# Altium project Soldeerstation.PrjPcb
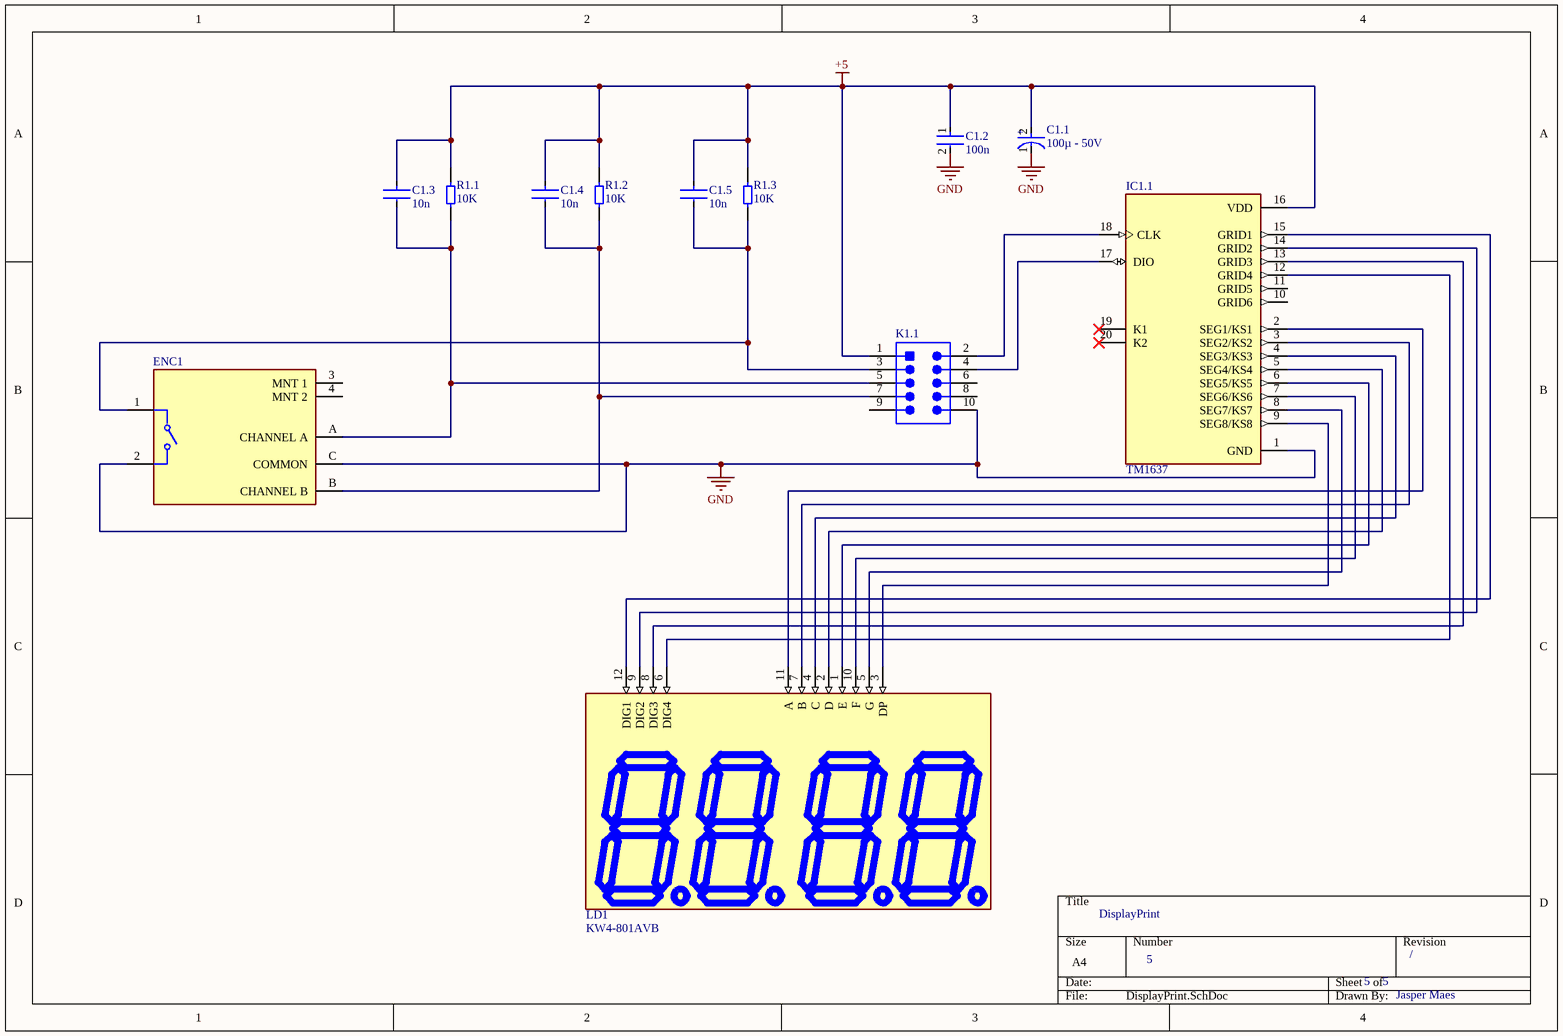
[diagram p0: DisplayPrint.SchDoc]
5 sheets, 76 parts. Net scope: flat (ports and power ports of the same name join across sheets).
Board file: PCB3.PcbDoc
Sheets:
  DisplayPrint.SchDoc
  Sturing_Bout.SchDoc
  Voeding.SchDoc
  Main_IC_Sheet.SchDoc
  temperatuursmeting.SchDoc

## Sheet DisplayPrint.SchDoc: DisplayPrint
size A4; Author: Jasper; DrawnBy: Jasper Maes; DocumentNumber: 5; Revision: /; SheetNumber: 5; SheetTotal: 5

### Parts
C1.1  100µ - 50V  [FP-RAD-TH-D_6_3_0_5-L_11-MFG]
C1.2  100n  [FP-C0805C-DN-IPC_A]
C1.3  10n  [FP-C0805C-DN-IPC_A]
C1.4  10n  [FP-C0805C-DN-IPC_A]
C1.5  10n  [FP-C0805C-DN-IPC_A]
ENC1  PEC11R-4215F-S0024  [FP-PEC11R-4215F-S0024-MFG]  (value not drawn)
IC1.1  TM1637  [N14A]
K1.1  1-1634688-0  [TECO-1-1634688-0-10_V]  (value not drawn)
LD1  KW4-801AVB  [LEDDIG_KW4-801AVB/KW4-801CVB_LUK]
R1.1  10K  [RESC2013X60X40ML20T25]
R1.2  10K  [RESC2013X60X40ML20T25]
R1.3  10K  [RESC2013X60X40ML20T25]

### Nets
+5: C1.1.2(A) C1.2.1 C1.3.1 C1.4.1 C1.5.1 IC1.1.16(VDD) K1.1.1 R1.1.1 R1.2.1 R1.3.1
GND: C1.1.1(C) C1.2.2 ENC1.2 ENC1.C(COMMON) IC1.1.1(GND) K1.1.10
NetC1.3_2: C1.3.2 ENC1.A(CHANNEL_A) K1.1.5 R1.1.2
NetC1.4_2: C1.4.2 ENC1.B(CHANNEL_B) K1.1.7 R1.2.2
NetC1.5_2: C1.5.2 ENC1.1 K1.1.3 R1.3.2
NetIC1.1_2: IC1.1.2(SEG1/KS1) LD1.11(A)
NetIC1.1_3: IC1.1.3(SEG2/KS2) LD1.7(B)
NetIC1.1_4: IC1.1.4(SEG3/KS3) LD1.4(C)
NetIC1.1_5: IC1.1.5(SEG4/KS4) LD1.2(D)
NetIC1.1_6: IC1.1.6(SEG5/KS5) LD1.1(E)
NetIC1.1_7: IC1.1.7(SEG6/KS6) LD1.10(F)
NetIC1.1_8: IC1.1.8(SEG7/KS7) LD1.5(G)
NetIC1.1_9: IC1.1.9(SEG8/KS8) LD1.3(DP)
NetIC1.1_12: IC1.1.12(GRID4) LD1.6(DIG4)
NetIC1.1_13: IC1.1.13(GRID3) LD1.8(DIG3)
NetIC1.1_14: IC1.1.14(GRID2) LD1.9(DIG2)
NetIC1.1_15: IC1.1.15(GRID1) LD1.12(DIG1)
NetIC1.1_17: IC1.1.17(DIO) K1.1.4
NetIC1.1_18: IC1.1.18(CLK) K1.1.2

Not connected (* = marked no-connect by the designer): ENC1 3(MNT_1) 4(MNT_2); IC1.1 10(GRID6) 11(GRID5) 19(K1)* 20(K2)*; K1.1 6 8 9

### Notes on the sheet
- (in symbol CMP-05427-000897-1) +

### Library data of the parts
C1.1 = CMP-05427-000897-1: Aluminum Electrolytic Capacitors (Radial Lead Type) 100uF ±20% 25V; ESR (Equivalent Series Resistance): 130mR; Ripple Current: 455mA; Polarity: Polar; Life (Hours): 2000Hour; Lead Diameter: 0.5mm; Tolerance: 20%; Radiation Hardening: No; Min Operating Temperature: -40°C; Series: FR; Max Operating Temperature: 105°C; Lead Free: Lead Free; Package Quantity: 2000; Capacitance: 100uF; Lead Pitch: 5mm; Voltage Rating (DC): 25V; Length: 11.2mm; Features: General Purpose; Mount: Through Hole; Voltage Rating: 25V; Case/Package: Radial; Impedance: 130mR; RoHS Compliant: Yes; Packaging: Tape and Reel; Height - Seated (Max): 0.441inch; Height: 11.2mm; Diameter: 6.3mm; Termination: Radial
C1.2-C1.5 = CMP-2007-00279-2: CAP CER 0.1UF 50V X7R 0805; Manufacturer Part Number: C0805C104K5RACTU; Manufacturer: KEMET; Value: 0.10 μF; Tolerance: 0.1; Temperature Coefficient: 30ppm/°C; Material: Ceramic; Device Class L2: Capacitors; Temperature Range Low: -55°C; Voltage Rating: 50 V; Digikey Description: CAP CER 0.1UF 50V X7R 0805; Category: Cap; ComponentLink2Description: Datasheet; Octopart: https://octopart.com/c0805c104k5ractu-kemet-143926; RoHS: TRUE; ComponentLink2URL: https://content.kemet.com/datasheets/KEM_C1003_C0G_SMD.pdf; Temperature Characteristic: X7R; Temperature: -55°C to +125°C; Height: 0.88mm; Temperature Range High: +125°C; Device Class L1: Passive Components; Automotive: No; Lead Free: Yes; Ipc Land Pattern Name: CAPC200125X78; Device Class L3: Ceramic Capacitors; Mouser Description: Cap Ceramic 0.1uF 50V X7R 10% SMD 2.0 x 1.2 mm 125 C Paper T/R; Capacitance: 0.10 μF; Package: C0805C-DN
ENC1 = CMP-1747-00012-2: ROTARY ENCODER MECHANICAL 24PPR; Hole Diameter: 1.8mm; Output Type: Quadrature; Pulses per Revolution: 24; Number of Channels: 2; Built in Switch: Yes; Min Operating Temperature: -30°C; Series: PEC11R; Type: Mechanical; Package Quantity: 150; Length: 21.5mm; Max Operating Temperature: 70°C; Encoder Type: Mechanical; Height: 13.4mm; Detent: Yes; Packaging: Bulk; Orientation: Vertical; Width: 12.5mm; Termination: PC Pins; Mount: Through Hole; REACH SVHC: No SVHC; Radiation Hardening: No; RoHS Compliant: Yes
IC1.1 = TM1637: LED Drive Control Special Circuit; MF: Titan Micro Electronics; Package: Package; Availability: Not in stock; SnapEDA_Link: https://www.snapeda.com/parts/TM1637/Titan+Micro+Electronics/view-part/?ref=snap; MP: TM1637; Check_prices: https://www.snapeda.com/parts/TM1637/Titan+Micro+Electronics/view-part/?ref=eda; Value: *; Price: None
K1.1 = CMP-2000-05854-1: Male Header, Pitch 2.54 mm, 2 x 5 Postion, Height 9.15 mm, Tail Length 3.2 mm, -40 to 105 degC, RoHS, Bulk; Manufacturer: TE Connectivity; No. of Rows: 2; SVHC: ToBeAdvised; Package Version: Rev. C2, 02/2011; No. of Contacts: 10Contacts; Pitch: 2.54mm; No. of Positions: 10; Contact Termination Type: ThroughHole; Package Description: 10-Pin Connector, Body 20.35 x 8.7 mm, Pitch 2.54 mm; Orientation: Straight; Gender: Header; Mounting Technology: ThroughHole; Product Range: -; PartNumber: 1-1634688-0; Datasheet Version: Rev. C2, 02/2011; Contact Material: Brass; Package URL: https://datasheet.ciiva.com/6831/eng-cd-1634688-c2-6831201.pdf; Package Reference: 1-1634688-0; Pitch Spacing: 2.54mm; Contact Plating: GoldPlatedContacts; Manufacturer URL: http://www.te.com/; Datasheet URL: https://datasheet.ciiva.com/6831/eng-cd-1634688-c2-6831201.pdf
LD1 = LDQ-M3604RI: Display, Seven Segment, 9.2MM, Red; MF: Lumex; MP: LDQ-M3604RI; Value: *; Check_prices: https://www.snapeda.com/parts/LDQ-M3604RI/Lumex/view-part/?ref=eda; Package: None; Price: None; Availability: In Stock; SnapEDA_Link: https://www.snapeda.com/parts/LDQ-M3604RI/Lumex/view-part/?ref=snap
R1.1-R1.3 = CMP-2001-00629-1_1: Part Number: ERA6AEB332V; Manufacturer: Panasonic

## Sheet Sturing_Bout.SchDoc: Sturing_Bout
size A4; Author: Jasper Maes; DrawnBy: Jasper Maes; DocumentNumber: 1; Revision: /; SheetNumber: 1; SheetTotal: 4
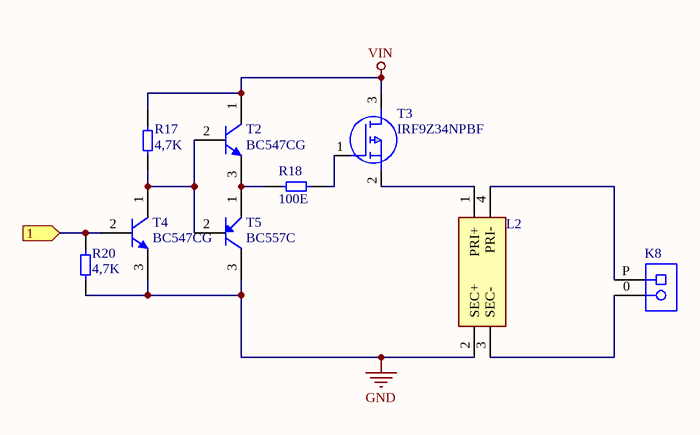
[diagram p1: Sturing_Bout.SchDoc]

### Parts
K8  1729128  [PHOE-1729128-2_V]  (value not drawn)
L2  (no value)  [CM2545X171B10]
R17  4,7K  [RESC2013X60X40ML20T25]
R18  100E  [RESC2013X60X40ML20T25]
R20  4,7K  [RESC2013X60X40ML20T25]
T2  BC547CG  [ONSC-TO-92-3-29-11]
T3  IRF9Z34NPBF  [TO254P469X1042X1967-3P]
T4  BC547CG  [ONSC-TO-92-3-29-11]
T5  BC557C  [ONSC-TO-92-3-29-11]

### Ports
1 (in, see Main_IC_Sheet[2C])

### Nets
GND: L2.2(SEC+) R20.2 T4.3(E) T5.3(E)
VIN: R17.1 T2.1(C) T3.3(D)
NetK8_0: K8.0 L2.3(SEC-)
NetK8_P: K8.P L2.4(PRI-)
NetL2_1: L2.1(PRI+) T3.2(S)
NetR17_2: R17.2 T2.2(B) T4.1(C) T5.2(B)
NetR18_1: R18.1 T2.3(E) T5.1(C)
NetR18_2: R18.2 T3.1(G)
NetR19_1: R20.1 T4.2(B) ; port 1

### Library data of the parts
K8 = CMP-2000-05815-1: PCB Terminal Block, 13.5 A, 400 V, 2-Pin THD, RoHS, Bulk; Manufacturer: Phoenix Contact; Package Version: 03/2015; No. of Rows: 1; Pitch: 5.08mm; No. of Positions: 2; Voltage Rating: 400V; Current Rating: 13500mA; Manufacturer URL: http://www.phoenixcontact.com/; Datasheet URL: https://datasheet.ciiva.com/16046/1729128-16046181.pdf; RoHS: TRUE; Package URL: https://www.phoenixcontact.com/online/portal/pi/pxc/product_detail_page/!ut/p/b1/3VdJjqNKFDxLH8AFycySyWY2ozFsEPOMMQaDOX1XedGL_1Vdm5YXJleknhSKeBkvI6EA8ncAo3AYoDhBQGco6KN7VURTdemj9us_IEKEZo_YHiPAEWEFmDGOHMORkqKYCORBZxgL7ZoaZYcbFFUZ3fqxSY6GOuxydWUuHqz1ynmMFygu583Bob0Ewr6Sd_l-5m-kAueHiB0jpRwZwe58wwtkpxtMYd_LmGcDRU02dRNEyWt6Y2ti5pSyJ_reIkzIulrqApdnbT11V5jnCKbYNCvhEM1MCpPByat_X379-iThf08CI5GfOPqfBeS3BRoBOdD55AKVv0iLwCMq-2BrzXWSGRH7pUGD9uwXQjiph3xL0DKQwdGa0JImiIOmBNOestqgwTHSSs2oOep-78apyXQBvNi8ZLaFjvjWvcaUEBu0MC6Wbe-d6mB0FAebo2lUWinqYaZs5DAYzV0RP9yitUjnGJ0iI9xhZkT42OCQNUJJhkgWINNQLP2JFP6OpMg3JCVg70jqHT0lvKOnhHf0lPuOnnLf0VPuWx6_dxwUIvwk5WMkT0kLL1mh61l2yZVSzG3pYV_bqo-mj6uMKwKwdnnW8Jh5RTOJzMOA5c-eJDaZQw4mTMPH02PvS_ZAqNVjVTo2WyYLkwH_KU1mmmG5kjRhDqPXLwwVHvVOjCM60-fpXvTDfMGW1PVFVS1r4e4yVDk4ZdNbkUHvqPqQSeian4UD39fNKmachqdJ1NJbyk8rXT9mXTvPk3oE5meulKGgiruPJek-4I9hTT6G8ZLOyRSm2RRVbThERQad5OS28hdt4YW4vG0stgYYzsWsK4_7y6DZMjJSCqri1kyiZR5vD7pwIrNR7QwPHTcLTI5qT7eRlpHrdGiupYlqQDJ7zy_CND8fWWBoLRXxk1RVcXiBQwbTD4Xi7KL-FuO94t9xaqweXzH; PartNumber: 1729128; Package Description: 2-Pin Through Hole Device, Body 8.1 x 10.16 mm, Pitch 5.08 mm; Datasheet Version: 12/2013; Mounting Technology: ThroughHole; Orientation: Horizontal; Package Reference: 1729128-2; Packing: Bulk
L2 = CM2545X171B-10_1: Common Mode Chokes Dual 170Ohm 100MHz 10A 0.01Ohm DCR Thru-Hole Bulk; Manufacturer_Name: Laird Technologies; Geometry.Height: 9.5mm; Mouser Part Number: N/A; Mouser Price/Stock: https://www.mouser.co.uk/ProductDetail/Laird/CM2545X171B-10?qs=PzGy0jfpSMtNfkEypgU65A%3D%3D; Manufacturer_Part_Number: CM2545X171B-10; Datasheet Link: https://datasheet.datasheetarchive.com/originals/dk/DKDS-7/122753.pdf
R17 R18 R20 = CMP-2001-00629-1_1: as R1.1 on sheet DisplayPrint
T2 T4 = CMP-1048-01464-1: Amplifier Transistor, NPN Silicon, 3-Pin TO-92, Pb-Free, Bulk Box; Manufacturer: On Semiconductor; IC Continuous (A): 0.1; fT Min (MHz): 150; ComponentLink3URL: http://www.onsemi.cn/pub_link/Collateral/2N6426-D.PDF; Mounting Technology: Through Hole; PackageReference: TO-92-3-29-11_AM_SL; ComponentLink2Description: Datasheet; RoHS: TRUE; Packing: Bulk Box; ComponentLink1Description: Manufacturer URL; PackageDescription: 3-Pin Transistor Outline, Body 4.825 x 3.685 mm, Pitch 1.27 mm; PackageVersion: Rev. AM; ComponentLink2URL: http://www.onsemi.com/pub_link/Collateral/BC546-D.PDF; ComponentLink3Description: Package Specification; ComponentLink1URL: http://www.onsemi.com/; DatasheetVersion: Rev. 7; Polarity: NPN; PartNumber: BC547CG
T3 = IRF9Z34NPBF: MOSFET MOSFT PCh -55V -17A 100mOhm 23.3nC; Manufacturer_Name: Infineon; Geometry.Height: 4.69mm; Mouser Part Number: 942-IRF9Z34NPBF; Mouser Price/Stock: https://www.mouser.co.uk/ProductDetail/Infineon-Technologies/IRF9Z34NPBF?qs=9%252BKlkBgLFf16a%2FvlD%252BMCtQ%3D%3D; Manufacturer_Part_Number: IRF9Z34NPBF; Datasheet Link: https://www.infineon.com/dgdl/irf9z34npbf.pdf?fileId=5546d462533600a40153561220af1ddd
T5 = CMP-1048-01449-1: Amplifier Transistor, PNP Silicon, 3-Pin TO-92, Bulk Box; Manufacturer: On Semiconductor; IC Continuous (A): -0.1; Polarity: PNP; PartNumber: BC557C; PackageVersion: Rev. AM; RoHS: FALSE; PackageDescription: 3-Pin Transistor Outline, Body 4.825 x 3.685 mm, Pitch 1.27 mm; Packing: Bulk Box; ComponentLink2Description: Datasheet; DatasheetVersion: Rev. 3; ComponentLink3Description: Package Specification; Mounting Technology: Through Hole; ComponentLink2URL: http://www.onsemi.com/pub_link/Collateral/BC556B-D.PDF; ComponentLink1URL: http://www.onsemi.com/; ComponentLink1Description: Manufacturer URL; ComponentLink3URL: http://www.onsemi.cn/pub_link/Collateral/2N6426-D.PDF; PackageReference: TO-92-3-29-11_AM_SL

## Sheet Voeding.SchDoc: VoedingsSchema
size A4; DrawnBy: Jasper Maes; DocumentNumber: 2; Revision: /; SheetNumber: 2; SheetTotal: 4
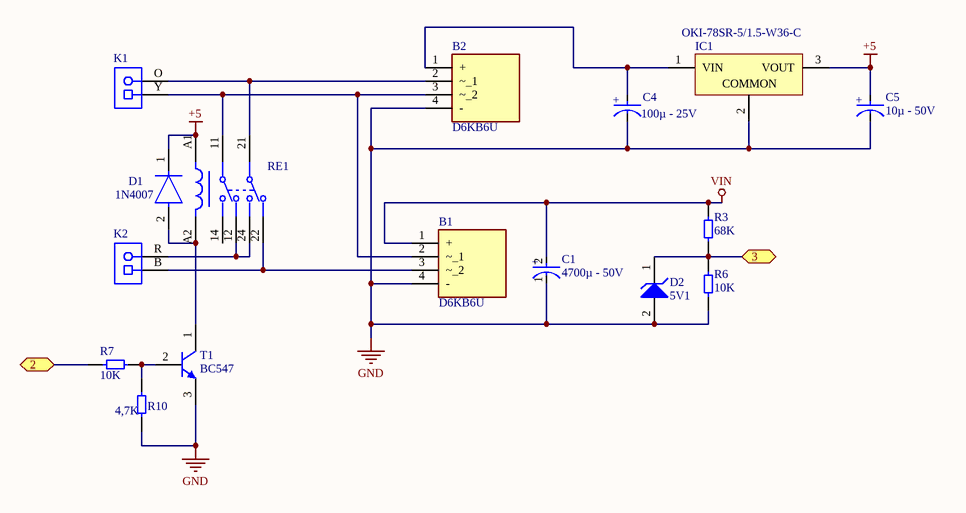
[diagram p2: Voeding.SchDoc]

### Parts
B1  D6KB6U  [GSIB1580E345]
B2  D6KB6U  [GSIB1580E345]
C1  4700µ - 50V  [U1-UU_NCH]
C4  100µ - 25V  [FP-RAD-TH-D_6_3_0_5-L_11-MFG]
C5  10µ - 50V  [CAPPRD200W52D525H1200]
D1  1N4007  [FP-1N4007-MFG]
D2  5V1  [FP-IR02-MFG]
IC1  OKI-78SR-5/1.5-W36-C  [MURA-OKI-78SR-3]
K1  1729128  [PHOE-1729128-2_V]  (value not drawn)
K2  1729128  [PHOE-1729128-2_V]  (value not drawn)
R3  68K  [RESC2013X60X40ML20T25]
R6  10K  [RESC2013X60X40ML20T25]
R7  10K  [RESC2013X60X40ML20T25]
R10  4,7K  [RESC2013X60X40ML20T25]
RE1  RT424005F  [FP-RT424005F-MFG]  (value not drawn)
T1  BC547  [ONSC-TO-92-3-29-11]

### Ports
2 (bidir, see Main_IC_Sheet[3C]), 3 (bidir, see Main_IC_Sheet[3B])

### Nets
+5: C5.2(A) D1.1(C) IC1.3(VOUT) RE1.A1
GND: B1.4(-) B2.4(-) C1.1(C) C4.1(C) C5.1(C) D2.2(A) IC1.2(COMMON) R6.2 R10.1 T1.3(E)
VIN: B1.1(+) C1.2(A) R3.2
NetB1_2: B1.2(~_1) B2.3(~_2) K1.Y RE1.11
NetB1_3: B1.3(~_2) K2.B RE1.22
NetB2_1: B2.1(+) C4.2(A) IC1.1(VIN)
NetB2_2: B2.2(~_1) K1.O RE1.21
NetD1_2: D1.2(A) RE1.A2 T1.1(C)
NetD2_1: D2.1(K) R3.1 R6.1 ; port 3
NetIC3_19: R7.1 ; port 2
NetK2_R: K2.R RE1.12 RE1.24
NetR7_2: R7.2 R10.2 T1.2(B)

Not connected (* = marked no-connect by the designer): RE1 14

### Notes on the sheet
- (in symbol CMP-05427-000897-1) +

### Library data of the parts
B1 B2 = GSIB1580-E3_45: Bridge Rectifier Diode 15A 800V GSIB-5S; Manufacturer_Name: Vishay; Manufacturer_Part_Number: GSIB1580-E3/45; Geometry.Height: 20.3mm; Mouser Part Number: 625-GSIB1580-E3; Mouser Price/Stock: https://www.mouser.co.uk/ProductDetail/Vishay-General-Semiconductor/GSIB1580-E3-45?qs=NyKJzQ80QAwZu8Guxd36Tw%3D%3D; Datasheet Link: http://www.vishay.com/docs/88644/gsib15xx.pdf
C1 C4 C5 = CMP-05427-000897-1: as C1.1 on sheet DisplayPrint; Tolerance: 20%; Radiation Hardening: No; Min Operating Temperature: -40°C; Series: FR; Max Operating Temperature: 105°C; Lead Free: Lead Free; Package Quantity: 2000; Capacitance: 100uF; Lead Pitch: 5mm; Voltage Rating (DC): 25V; Length: 11.2mm; Features: General Purpose; Mount: Through Hole; Voltage Rating: 25V; Case/Package: Radial; Impedance: 130mR; RoHS Compliant: Yes; Packaging: Tape and Reel; Height - Seated (Max): 0.441inch; Height: 11.2mm; Diameter: 6.3mm; Termination: Radial
D1 = CMP-123542-000001-1: Rectifier diode 1000 V 1 A DO-41, ,; Manufacturer: Diotec; Max Surge Forward Current: 27A; Forward Current: 1A; Max Junction Temp: +175°C; Reverse Voltage: 1000V; Value: 15pF; Peak Reverse Current: 5uA; Category: Diode; Temperature Range Low: -50°C; Automotive: No; Temperature: -50°C to +175°C; Lead Free: Yes; ComponentLink2Description: Datasheet; Max Repetitive Reverse Voltage: 1000V; ComponentLink2URL: https://datasheet.octopart.com/1N4007-Diotec-datasheet-62346875.pdf; Manufacturer Part Number: 1N4007; Device Class L3: Rectifier Diodes; Height: 2.8mm; Octopart: https://octopart.com/1n4007-diotec-4040411; Package: 1N4007; Temperature Range High: +175°C; Device Class L1: Discrete Semiconductors; Device Class L2: Diodes; RoHS: TRUE; Capacitance: 15pF; Ipc Land Pattern Name: DIOAD888W100L520D280
D2 = CMP-1060-00390-1: Zener Voltage Regulator, 500 mW, 2-Pin SOD-123, Pb-Free, Tape and Reel; Manufacturer: On Semiconductor; PartNumber: MMSZ4689ET1G; VZ Typ (V): 5.1; P Max (W): 0.5; ComponentLink3URL: http://www.onsemi.com/pub_link/Collateral/425-04.PDF; Packing: Tape and Reel; ComponentLink2Description: Datasheet; DatasheetVersion: Rev. 6; ComponentLink1Description: Manufacturer URL; ComponentLink1URL: http://www.onsemi.com/; RoHS: Pb-Free; PackageReference: SOD-123-2-425-04; PackageVersion: Rev. G, 10/2009; PackageDescription: 2-Pin SOD, Body 1.6 x 2.69 mm; ComponentLink2URL: http://www.onsemi.com/pub_link/Collateral/MMSZ4678ET1-D.PDF; Mounting Technology: Surface Mount; ComponentLink3Description: Package Specification
IC1 = CMP-2000-05274-1: Non-Isolated DC/DC Converter, 7.5 W, 7 to 36 V, 1.5 A, -40 to 85 degC, 3-Pin THD, RoHS; Manufacturer: Murata; Current - Output (Max): 1.5A; Power (Watts) - Max: 8W; Efficiency: 90.5%; Voltage - Input (Min): 7V; Voltage - Input (Max): 36V; Voltage - Output 1: 5V; Number of Outputs: 1; Package / Case: 3-SIPModule; Features: SCP; Type: LinearRegulatorReplacement; Size / Dimension: 0.41"Lx0.30"Wx0.65"H(10.4mmx7.6mmx16.5mm); Datasheet URL: https://datasheet.ciiva.com/8006/1790439-8006672.pdf; Datasheet Version: Oct-13; Power (Watts) - Manufacture Series: 8W; Voltage - Output 2: -; Series: Okami™OKI-78SR; Family: DCDCConverters; Manufacturer URL: http://www.murata.com/; Category: PowerSupplies-BoardMount; Voltage - Isolation: -; Packaging: Tube; Applications: ITE(Commercial); Mounting Type: ThroughHole; Voltage - Output 3: -; Operating Temperature: -40degC~85degC
K1 K2 = CMP-2000-05815-1: as K8 on sheet Sturing_Bout; Manufacturer URL: http://www.phoenixcontact.com/; Datasheet URL: https://datasheet.ciiva.com/16046/1729128-16046181.pdf; RoHS: TRUE; Package URL: https://www.phoenixcontact.com/online/portal/pi/pxc/product_detail_page/!ut/p/b1/3VdJjqNKFDxLH8AFycySyWY2ozFsEPOMMQaDOX1XedGL_1Vdm5YXJleknhSKeBkvI6EA8ncAo3AYoDhBQGco6KN7VURTdemj9us_IEKEZo_YHiPAEWEFmDGOHMORkqKYCORBZxgL7ZoaZYcbFFUZ3fqxSY6GOuxydWUuHqz1ynmMFygu583Bob0Ewr6Sd_l-5m-kAueHiB0jpRwZwe58wwtkpxtMYd_LmGcDRU02dRNEyWt6Y2ti5pSyJ_reIkzIulrqApdnbT11V5jnCKbYNCvhEM1MCpPByat_X379-iThf08CI5GfOPqfBeS3BRoBOdD55AKVv0iLwCMq-2BrzXWSGRH7pUGD9uwXQjiph3xL0DKQwdGa0JImiIOmBNOestqgwTHSSs2oOep-78apyXQBvNi8ZLaFjvjWvcaUEBu0MC6Wbe-d6mB0FAebo2lUWinqYaZs5DAYzV0RP9yitUjnGJ0iI9xhZkT42OCQNUJJhkgWINNQLP2JFP6OpMg3JCVg70jqHT0lvKOnhHf0lPuOnnLf0VPuWx6_dxwUIvwk5WMkT0kLL1mh61l2yZVSzG3pYV_bqo-mj6uMKwKwdnnW8Jh5RTOJzMOA5c-eJDaZQw4mTMPH02PvS_ZAqNVjVTo2WyYLkwH_KU1mmmG5kjRhDqPXLwwVHvVOjCM60-fpXvTDfMGW1PVFVS1r4e4yVDk4ZdNbkUHvqPqQSeian4UD39fNKmachqdJ1NJbyk8rXT9mXTvPk3oE5meulKGgiruPJek-4I9hTT6G8ZLOyRSm2RRVbThERQad5OS28hdt4YW4vG0stgYYzsWsK4_7y6DZMjJSCqri1kyiZR5vD7pwIrNR7QwPHTcLTI5qT7eRlpHrdGiupYlqQDJ7zy_CND8fWWBoLRXxk1RVcXiBQwbTD4Xi7KL-FuO94t9xaqweXzH; PartNumber: 1729128; Package Description: 2-Pin Through Hole Device, Body 8.1 x 10.16 mm, Pitch 5.08 mm; Datasheet Version: 12/2013; Mounting Technology: ThroughHole; Orientation: Horizontal; Package Reference: 1729128-2; Packing: Bulk
R3 R6 R7 R10 = CMP-2001-00629-1_1: as R1.1 on sheet DisplayPrint
RE1 = CMP-03395-000296-1: RELAY GENERAL PURPOSE DPDT 8A 5V; Power Consumption: 400mW; Coil Current: 80.6mA; Max Voltage Rating (AC): 400V; Coil Power: 500mW; Dropout Voltage: 500mV; Operate Time: 7ms; Contact Voltage Rating (AC): 250V; Coil Type: Non-Latching; Coil Resistance: 62R; Release Time: 3ms; Max Operating Temperature: 85°C; Package Quantity: 5000; Relay Type: General Purpose; Series: RT2; Lead Free: Lead Free; Coil Voltage (DC): 5V; Contact Current Rating: 8A; Packaging: Carton; Height: 15.7mm; Mount: Through Hole; Width: 12.7mm; ELV: Compliant; Termination: PCB; Contact Material: Silver; Throw Configuration: DPDT; Min Operating Temperature: -40°C; Weight: 13g; RoHS Compliant: Yes; Length: 29mm; Radiation Hardening: No
T1 = CMP-1048-01464-1: Amplifier Transistor, NPN Silicon, 3-Pin TO-92, Pb-Free, Bulk Box; Manufacturer: On Semiconductor; PartNumber: BC547CG; IC Continuous (A): 0.1; fT Min (MHz): 150; ComponentLink3URL: http://www.onsemi.cn/pub_link/Collateral/2N6426-D.PDF; Mounting Technology: Through Hole; PackageReference: TO-92-3-29-11_AM_SL; ComponentLink2Description: Datasheet; RoHS: TRUE; Packing: Bulk Box; ComponentLink1Description: Manufacturer URL; PackageDescription: 3-Pin Transistor Outline, Body 4.825 x 3.685 mm, Pitch 1.27 mm; PackageVersion: Rev. AM; ComponentLink2URL: http://www.onsemi.com/pub_link/Collateral/BC546-D.PDF; ComponentLink3Description: Package Specification; ComponentLink1URL: http://www.onsemi.com/; DatasheetVersion: Rev. 7; Polarity: NPN

## Sheet Main_IC_Sheet.SchDoc: Main IC - ATMEG
size A4; DrawnBy: Jasper Maes; DocumentNumber: 3; Revision: /; SheetNumber: 3; SheetTotal: 4
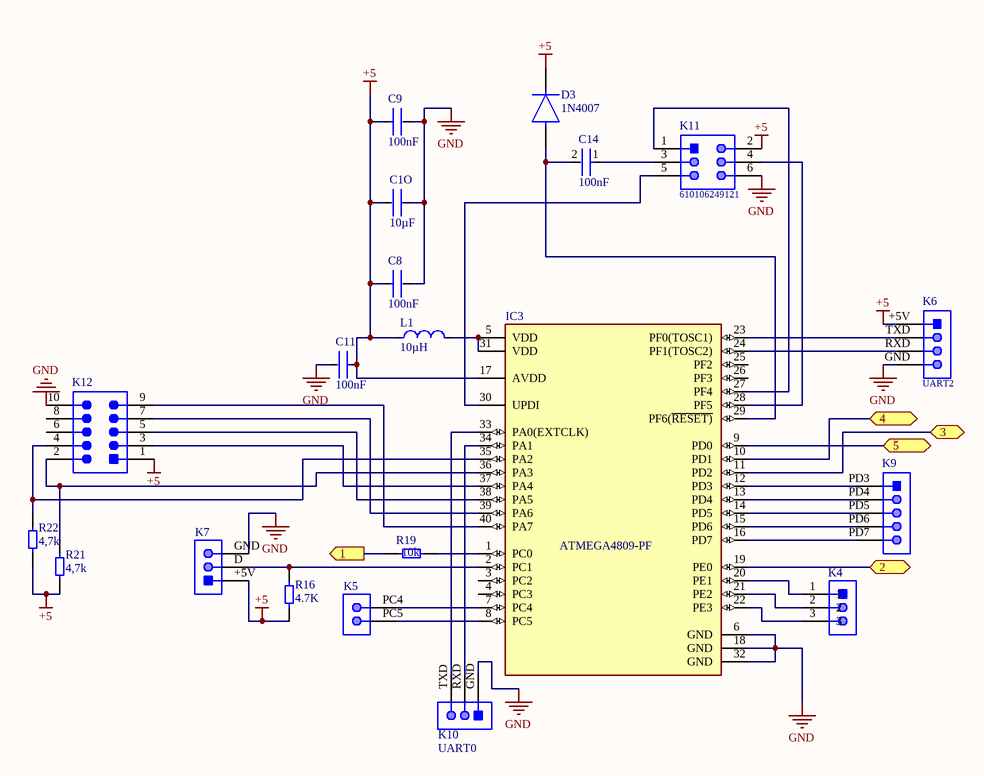
[diagram p3: Main_IC_Sheet.SchDoc]

### Parts
C1O  10µF  [CAPPRD200W52D525H1200]
C8  100nF  [FP-C0805C-DN-IPC_A]
C9  100nF  [FP-C0805C-DN-IPC_A]
C11  100nF  [FP-C0805C-DN-IPC_A]
C14  100nF  [FP-C0805C-DN-IPC_A]
D3  1N4007  [FP-1N4007-MFG]
IC3  ATMEGA4809-PF  [FP-C04-016-MFG]
K4  (no value)  [MOLX-22-28-4033_V]
K5  (no value)  [TECO-5-146280-2_V]
K6  UART2  [61300411121]
K7  (no value)  [MOLX-22-28-4033_V]
K9  691701320005B  [61300511121]  (value not drawn)
K10  UART0  [MOLX-22-28-4033_V]
K11  610106249121  [SMTC-TSW-103-08-L-D_V]
K12  (no value)  [TECO-1-1634688-0-10_V]
L1  10µH  [FP-IR02-MFG]
R16  4.7K  [RESC2013X60X40ML20T25]
R19  10k  [RESC2013X60X40ML20T25]
R21  4,7k  [RESC2013X60X40ML20T25]
R22  4,7k  [RESC2013X60X40ML20T25]

### Ports
1 (out, see Sturing_Bout[2C]), 2 (bidir, see Voeding[1C]), 3 (bidir, see Voeding[3C]), 4 (bidir, see temperatuursmeting[2B]), 5 (bidir, see temperatuursmeting[2B])

### Nets
+5: C1O.2 C8.1 C9.1 C11.1 D3.1(C) IC3.17(AVDD) K6.+5V K7.+5V K11.2 K12.1 L1.1 R16.2 R21.1 R22.1
GND: C1O.1 C8.2 C9.2 C11.2 IC3.6(GND) IC3.18(GND) IC3.32(GND) K6.GND K7.GND K10.GND K11.6 K12.10
NetC6_1: IC3.9(PD0) ; port 5
NetC12_1: IC3.10(PD1) ; port 4
NetC14_1: C14.1 K11.3
NetC14_2: C14.2 D3.2(A) IC3.29(PF6(~{RESET)})
NetD2_1: IC3.11(PD2) ; port 3
NetIC3_1: IC3.1(PC0) R19.2
NetIC3_2: IC3.2(PC1) K7.D R16.1
NetIC3_5: IC3.5(VDD) IC3.31(VDD) L1.2
NetIC3_7: IC3.7(PC4) K5.PC4
NetIC3_8: IC3.8(PC5) K5.PC5
NetIC3_12: IC3.12(PD3) K9.PD3
NetIC3_13: IC3.13(PD4) K9.PD4
NetIC3_14: IC3.14(PD5) K9.PD5
NetIC3_15: IC3.15(PD6) K9.PD6
NetIC3_16: IC3.16(PD7) K9.PD7
NetIC3_19: IC3.19(PE0) ; port 2
NetIC3_20: IC3.20(PE1) K4.1
NetIC3_21: IC3.21(PE2) K4.2
NetIC3_22: IC3.22(PE3) K4.3
NetIC3_23: IC3.23(PF0(TOSC1)) K6.TXD
NetIC3_24: IC3.24(PF1(TOSC2)) K6.RXD
NetIC3_27: IC3.27(PF4) K11.1
NetIC3_28: IC3.28(PF5) K11.4
NetIC3_30: IC3.30(UPDI) K11.5
NetIC3_33: IC3.33(PA0(EXTCLK)) K10.TXD
NetIC3_34: IC3.34(PA1) K10.RXD
NetIC3_35: IC3.35(PA2) K12.4 R22.2
NetIC3_36: IC3.36(PA3) K12.2 R21.2
NetIC3_37: IC3.37(PA4) K12.3
NetIC3_38: IC3.38(PA5) K12.5
NetIC3_39: IC3.39(PA6) K12.7
NetIC3_40: IC3.40(PA7) K12.9
NetR19_1: R19.1 ; port 1

Not connected (* = marked no-connect by the designer): IC3 3(PC2) 4(PC3) 25(PF2) 26(PF3); K12 6 8

### Library data of the parts
C1O C8 C9 C11 C14 = CMP-2007-00279-2: as C1.2 on sheet DisplayPrint; Device Class L2: Capacitors; Temperature Range Low: -55°C; Voltage Rating: 50 V; Digikey Description: CAP CER 0.1UF 50V X7R 0805; Category: Cap; ComponentLink2Description: Datasheet; Octopart: https://octopart.com/c0805c104k5ractu-kemet-143926; RoHS: TRUE; ComponentLink2URL: https://content.kemet.com/datasheets/KEM_C1003_C0G_SMD.pdf; Temperature Characteristic: X7R; Temperature: -55°C to +125°C; Height: 0.88mm; Temperature Range High: +125°C; Device Class L1: Passive Components; Automotive: No; Lead Free: Yes; Ipc Land Pattern Name: CAPC200125X78; Device Class L3: Ceramic Capacitors; Mouser Description: Cap Ceramic 0.1uF 50V X7R 10% SMD 2.0 x 1.2 mm 125 C Paper T/R; Capacitance: 0.10 μF; Package: C0805C-DN
D3 = CMP-123542-000001-1: as D1 on sheet Voeding; Category: Diode; Temperature Range Low: -50°C; Automotive: No; Temperature: -50°C to +175°C; Lead Free: Yes; ComponentLink2Description: Datasheet; Max Repetitive Reverse Voltage: 1000V; ComponentLink2URL: https://datasheet.octopart.com/1N4007-Diotec-datasheet-62346875.pdf; Manufacturer Part Number: 1N4007; Device Class L3: Rectifier Diodes; Height: 2.8mm; Octopart: https://octopart.com/1n4007-diotec-4040411; Package: 1N4007; Temperature Range High: +175°C; Device Class L1: Discrete Semiconductors; Device Class L2: Diodes; RoHS: TRUE; Capacitance: 15pF; Ipc Land Pattern Name: DIOAD888W100L520D280
IC3 = CMP-06276-000616-1: IC MCU 8BIT 48KB FLASH 40DIP; RoHS Compliant: Yes
K4 K7 K10 = CMP-1676-00001-5: Male Header, Pitch 2.54 mm, 1 x 3 Position, Height 8.38 mm, Tail Length 3.18 mm, RoHS, Bulk; Manufacturer: Molex; Rows: 1; Voltage Rating: 250 V; Current Rating: 4 A; Min Operating Temperature: 0 degC; Lead Pitch: 0.1 inch; Packaging: Bulk; Contact Finish: Gold; RoHSCompliant: true; Contact Material: Brass; PackageReference: 22-28-4033; REACH SVHC: Unknown; PackageDescription: Male Header, Pitch 2.54 mm, 1 x 3 Position, Height 8.38 mm, Tail Length 3.18 mm; ComponentLink2URL: http://www.molex.com/pdm_docs/sd/022284033_sd.pdf; Height: 8.38 mm; Mounting Technology: Through Hole; ComponentLink1Description: Manufacturer URL; Length: 7.62 mm; Mount: Through Hole; DatasheetVersion: Rev. G, 01/2012; Max Operating Temperature: 75 degC; ComponentLink2Description: Datasheet; Colour: Black; Pins: 3; Contact Plating: Gold; Package Quantity: 1; ComponentLink1URL: http://www.molex.com/
K5 = CMP-2000-07492-1: Male Header, Pitch 2.54 mm, 1 x 2 Position, Height 8.21 mm, Tail Length 3.05 mm, -65 to 105 degC, RoHS, Bulk; Manufacturer: TE Connectivity; Mating Connector Lock: No(Without); Number of Positions: 2; Pitch: 2.54mm; PCB Mounting Orientation: Vertical; Keyed: No; Case\/Package: 100; Mating Post Length: 0.23inch; High Temperature Housing: Yes; Max Current Rating: 5A; PCB Thickness: 0.063inch; PCB Mount Retention: Without; Approvals: CSA; Current Rating: 3A; Radiation Hardening: No; Length: 4.67mm; Contact Mating Length: 0.23inch; Connector Type: Header; Number of Rows: 1; Termination Post Length: 0.12inch; Board Standoff: No(Without); Max Operating Temperature: 105degC; Contact Shape: Square; Selectively Loaded: No(Without); Gasket: No(Without); Number of Contacts: 2; Contact Gender: Male; Mating Alignment: No(Without); Manufacturer URL: http://www.te.com/; Datasheet URL: http://www.te.com/commerce/DocumentDelivery/DDEController?Action=showdoc&DocId=Customer+Drawing%7F146280%7FH1%7Fpdf%7FEnglish%7FENG_CD_146280_H1.pdf%7F5-146280-2; Mount: ThroughHole; Orientation: Straight; Packaging: Carton; Package Reference: 5-146280-2; Package Quantity: 500; Stabilizers: No(Without); Row Spacing: 2.54mm; Contact Material: CopperAlloy; Panel Mount Retention: No(Without); Datasheet Version: Rev. H1, 08/2016; Housing Colour: Black; Colour: Black; Package Description: Male Header, Pitch 2.54 mm, 1 x 2 Position, Height 8.21 mm, Tail Length 3.05 mm; Contact Plating: Matte; Housing Material: Polymer; Contact Protection: No(Without); Min Operating Temperature: -65degC; Mounting Technology: ThroughHole; Flammability Rating: UL94V-0; RoHSCompliant: true; Termination: ThroughHole; Depth: 2.34mm; High Speed Serial Data Connector: No
K6 = CMP-1502-01064-1: THT Vertical Pin Header WR-PHD, Pitch 2.54 mm, Single Row, 4 pins; Manufacturer: Wurth Elektronik; Withstanding Voltage: 500VAC; Rated Current: 3A; Working Voltage: 250VAC; Pin Number: 4; Gender: Male; Contact Resistance: 20mOhm; Pitch: 2.54mm; Manufacturer URL: http://www.we-online.de; Operating Temperature: -40to105degC; Packaging: Bag; Mounting Technology: THT; Package Reference: 61300411121; Datasheet URL: https://katalog.we-online.de/em/datasheet/6130xx11121.pdf; Publisher: WurthElektronik; Part Number: 61300411121; Row Number: Single; Orientation: Vertical
K9 = CMP-1502-01995-1: Serie 7013 B - 3.81mm Vertical PCB Header THR Type with Flanges WR-TBL, 5 pin; Manufacturer: Wurth Elektronik; Gender: Male; Pin Number: 5; Mounting Technology: SMT; Part Number: 691701320005B; Package Reference: 691701320005B; Pitch: 3.81mm; Operating Temperature: -40to105degC; Datasheet URL: http://katalog.we-online.de/em/datasheet/6917013200xxB.pdf; Publisher: WurthElektronik; Manufacturer URL: http://www.we-online.de; Packaging: TapeandReelwithCap
K11 = CMP-1502-01146-1: SMT Angled Pin Header WR-PHD, Pitch 2.54 mm, Dual Row, 6 pins; Manufacturer: Wurth Elektronik; Contact Resistance: 20mOhm; Gender: Male; Withstanding Voltage: 600VAC; Working Voltage: 250VAC; Rated Current: 3A; Pitch: 2.54mm; Pin Number: 6; Package Reference: 610106249121; Mounting Technology: SMT; Row Number: Dual; Manufacturer URL: http://www.we-online.de; Operating Temperature: -40to105degC; Publisher: WurthElektronik; Datasheet URL: https://katalog.we-online.de/em/datasheet/6101xx249121.pdf; Packaging: TapeandReel; Orientation: Angled; Part Number: 610106249121
K12 = CMP-2000-05854-1: Male Header, Pitch 2.54 mm, 2 x 5 Postion, Height 9.15 mm, Tail Length 3.2 mm, -40 to 105 degC, RoHS, Bulk; Manufacturer: TE Connectivity; PartNumber: 1-1634688-0; No. of Rows: 2; SVHC: ToBeAdvised; Package Version: Rev. C2, 02/2011; No. of Contacts: 10Contacts; Pitch: 2.54mm; No. of Positions: 10; Contact Termination Type: ThroughHole; Package Description: 10-Pin Connector, Body 20.35 x 8.7 mm, Pitch 2.54 mm; Orientation: Straight; Gender: Header; Mounting Technology: ThroughHole; Product Range: -; Datasheet Version: Rev. C2, 02/2011; Contact Material: Brass; Package URL: https://datasheet.ciiva.com/6831/eng-cd-1634688-c2-6831201.pdf; Package Reference: 1-1634688-0; Pitch Spacing: 2.54mm; Contact Plating: GoldPlatedContacts; Manufacturer URL: http://www.te.com/; Datasheet URL: https://datasheet.ciiva.com/6831/eng-cd-1634688-c2-6831201.pdf
L1 = CMP-03630-000001-1: IR-2 10 10% B08; Obsolete Part: true; Manufacturer: Vishay Dale; Manufacturer Part Number: IR02BH100K; Core Material: Iron; Value: 10uH; Test Frequency: 7.9MHz; Saturation Current: 130mA; Series Resistance: 3.7Ω; Q Factor: 55; Self Resonant Frequency: 50MHz; Device Class L2: Inductors; ComponentLink2Description: Datasheet; Temperature Range Low: -55°C; Digikey Description: IR-2 10 10% B08; Temperature Range High: +105°C; Inductance: 10uH; Height: 3.05mm; Package: IR02; Tolerance: 10%; Device Class L1: Passive Components; Category: Ind; Device Class L3: Fixed Inductors; RoHS: TRUE; Octopart: https://octopart.com/ir02bh100k-vishay+dale-39675774; Temperature: -55°C to +105°C; Ipc Land Pattern Name: CAPAD1147W70L838D305; Lead Free: Yes; ComponentLink2URL: https://datasheet.ciiva.com/8536/ir-8536517.pdf; Automotive: No; Mouser Description: Fixed Inductors 10uH 10%
R16 R19 R21 R22 = CMP-2001-00629-1_1: as R1.1 on sheet DisplayPrint

## Sheet temperatuursmeting.SchDoc: Temperatuursmeting
size A4; DrawnBy: Jasper Maes; DocumentNumber: 4; Revision: /; SheetNumber: 4; SheetTotal: 4
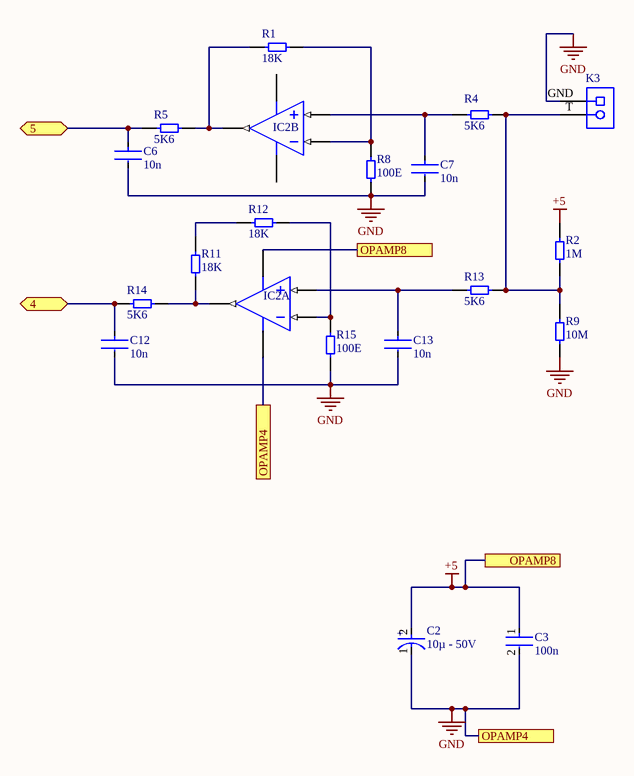
[diagram p4: temperatuursmeting.SchDoc]

### Parts
C2  10µ - 50V  [CAPPRD200W52D525H1200]
C3  100n  [FP-C0805C-DN-IPC_A]
C6  10n  [FP-C0805C-DN-IPC_A]
C7  10n  [FP-C0805C-DN-IPC_A]
C12  10n  [FP-C0805C-DN-IPC_A]
C13  10n  [FP-C0805C-DN-IPC_A]
IC2  MCP6002-E/P  [PDIP300-P8]  (value not drawn)  (parts A,B of 2)
K3  1729128  [PHOE-1729128-2_V]  (value not drawn)
R1  18K  [RESC2013X60X40ML20T25]
R2  1M  [RESC2013X60X40ML20T25]
R4  5K6  [RESC2013X60X40ML20T25]
R5  5K6  [RESC2013X60X40ML20T25]
R8  100E  [RESC2013X60X40ML20T25]
R9  10M  [RESC2013X60X40ML20T25]
R11  18K  [RESC2013X60X40ML20T25]
R12  18K  [RESC2013X60X40ML20T25]
R13  5K6  [RESC2013X60X40ML20T25]
R14  5K6  [RESC2013X60X40ML20T25]
R15  100E  [RESC2013X60X40ML20T25]

### Ports
4 (bidir, see Main_IC_Sheet[3B]), 5 (bidir, see Main_IC_Sheet[3B]), OPAMP4 (see temperatuursmeting[2C]), OPAMP4 (see temperatuursmeting[3D]), OPAMP8 (see temperatuursmeting[2B]), OPAMP8 (see temperatuursmeting[3C])

### Nets
+5: C2.2(A) C3.1 IC2.4(VSS) R2.1 ; port OPAMP8
GND: C2.1(C) C3.2 C6.2 C7.2 C12.2 C13.2 IC2.8(VDD) K3.GND R8.2 R9.2 R15.2 ; port OPAMP4
NetC6_1: C6.1 R5.1 ; port 5
NetC7_1: C7.1 IC2.5(VINB+) R4.1
NetC12_1: C12.1 R14.1 ; port 4
NetC13_1: C13.1 IC2.3(VINA+) R13.1
NetIC2_1: IC2.1(VOUTA) R11.2 R14.2
NetIC2_2: IC2.2(VINA-) R12.2 R15.1
NetIC2_6: IC2.6(VINB-) R1.2 R8.1
NetIC2_7: IC2.7(VOUTB) R1.1 R5.2
NetK3_T: K3.T R2.2 R4.2 R9.1 R13.2
NetR11_1: R11.1 R12.1

### Notes on the sheet
- (in symbol CMP-05427-000897-1) +

### Library data of the parts
C2 = CMP-05427-000897-1: as C1.1 on sheet DisplayPrint; Tolerance: 20%; Radiation Hardening: No; Min Operating Temperature: -40°C; Series: FR; Max Operating Temperature: 105°C; Lead Free: Lead Free; Package Quantity: 2000; Capacitance: 100uF; Lead Pitch: 5mm; Voltage Rating (DC): 25V; Length: 11.2mm; Features: General Purpose; Mount: Through Hole; Voltage Rating: 25V; Case/Package: Radial; Impedance: 130mR; RoHS Compliant: Yes; Packaging: Tape and Reel; Height - Seated (Max): 0.441inch; Height: 11.2mm; Diameter: 6.3mm; Termination: Radial
C3 C6 C7 C12 C13 = CMP-2007-00279-2: as C1.2 on sheet DisplayPrint; Device Class L2: Capacitors; Temperature Range Low: -55°C; Voltage Rating: 50 V; Digikey Description: CAP CER 0.1UF 50V X7R 0805; Category: Cap; ComponentLink2Description: Datasheet; Octopart: https://octopart.com/c0805c104k5ractu-kemet-143926; RoHS: TRUE; ComponentLink2URL: https://content.kemet.com/datasheets/KEM_C1003_C0G_SMD.pdf; Temperature Characteristic: X7R; Temperature: -55°C to +125°C; Height: 0.88mm; Temperature Range High: +125°C; Device Class L1: Passive Components; Automotive: No; Lead Free: Yes; Ipc Land Pattern Name: CAPC200125X78; Device Class L3: Ceramic Capacitors; Mouser Description: Cap Ceramic 0.1uF 50V X7R 10% SMD 2.0 x 1.2 mm 125 C Paper T/R; Capacitance: 0.10 μF; Package: C0805C-DN
IC2 = CMP-0187-00133-3: None; Slew Rate: 0.6V/µs; Supply Current: 100uA; Power Supply Rejection Ratio (PSRR): 86dB; Input Offset Voltage (Vos): 4.5mV; Input Bias Current: 1pA; Amplifier Type: GENERAL PURPOSE; Unity Gain Bandwidth Product: 1MHz; Number of Circuits: 2; Output Current: 23mA; Operating Supply Voltage: 5.5V; Min Supply Voltage: 1.8V; Common Mode Rejection Ratio: 60dB; Voltage Gain: 112dB; Max Supply Voltage: 6V; Package Quantity: 60; REACH SVHC: No SVHC; Min Operating Temperature: -40°C; Max Operating Temperature: 125°C; Mount: Through Hole; Nominal Supply Current: 100uA; Height: 3.3mm; Length: 9.27mm; Slew Rate-Nom: 0.6V/µs; Packaging: Rail/Tube; Output Current per Channel: 23mA; Number of Amplifiers: 2; RoHS Compliant: Yes; Radiation Hardening: No; Bandwidth: 1MHz; Lead Free: Lead Free; Width: 6.35mm; Number of Channels: 2; Gain Bandwidth Product: 1MHz; Technology: CMOS; Operating Supply Current: 100uA; Number of Elements: 2; Number of Pins: 8; Input Offset Voltage-Max: 4.5mV; Case/Package: PDIP
K3 = CMP-2000-05815-1: as K8 on sheet Sturing_Bout; Manufacturer URL: http://www.phoenixcontact.com/; Datasheet URL: https://datasheet.ciiva.com/16046/1729128-16046181.pdf; RoHS: TRUE; Package URL: https://www.phoenixcontact.com/online/portal/pi/pxc/product_detail_page/!ut/p/b1/3VdJjqNKFDxLH8AFycySyWY2ozFsEPOMMQaDOX1XedGL_1Vdm5YXJleknhSKeBkvI6EA8ncAo3AYoDhBQGco6KN7VURTdemj9us_IEKEZo_YHiPAEWEFmDGOHMORkqKYCORBZxgL7ZoaZYcbFFUZ3fqxSY6GOuxydWUuHqz1ynmMFygu583Bob0Ewr6Sd_l-5m-kAueHiB0jpRwZwe58wwtkpxtMYd_LmGcDRU02dRNEyWt6Y2ti5pSyJ_reIkzIulrqApdnbT11V5jnCKbYNCvhEM1MCpPByat_X379-iThf08CI5GfOPqfBeS3BRoBOdD55AKVv0iLwCMq-2BrzXWSGRH7pUGD9uwXQjiph3xL0DKQwdGa0JImiIOmBNOestqgwTHSSs2oOep-78apyXQBvNi8ZLaFjvjWvcaUEBu0MC6Wbe-d6mB0FAebo2lUWinqYaZs5DAYzV0RP9yitUjnGJ0iI9xhZkT42OCQNUJJhkgWINNQLP2JFP6OpMg3JCVg70jqHT0lvKOnhHf0lPuOnnLf0VPuWx6_dxwUIvwk5WMkT0kLL1mh61l2yZVSzG3pYV_bqo-mj6uMKwKwdnnW8Jh5RTOJzMOA5c-eJDaZQw4mTMPH02PvS_ZAqNVjVTo2WyYLkwH_KU1mmmG5kjRhDqPXLwwVHvVOjCM60-fpXvTDfMGW1PVFVS1r4e4yVDk4ZdNbkUHvqPqQSeian4UD39fNKmachqdJ1NJbyk8rXT9mXTvPk3oE5meulKGgiruPJek-4I9hTT6G8ZLOyRSm2RRVbThERQad5OS28hdt4YW4vG0stgYYzsWsK4_7y6DZMjJSCqri1kyiZR5vD7pwIrNR7QwPHTcLTI5qT7eRlpHrdGiupYlqQDJ7zy_CND8fWWBoLRXxk1RVcXiBQwbTD4Xi7KL-FuO94t9xaqweXzH; PartNumber: 1729128; Package Description: 2-Pin Through Hole Device, Body 8.1 x 10.16 mm, Pitch 5.08 mm; Datasheet Version: 12/2013; Mounting Technology: ThroughHole; Orientation: Horizontal; Package Reference: 1729128-2; Packing: Bulk
R1 R2 R4 R5 R8 R9 R11-R15 = CMP-2001-00629-1_1: as R1.1 on sheet DisplayPrint

## Nets that join several sheets
+5: DisplayPrint (10 pins), Voeding (C5.2 D1.1 IC1.3 RE1.A1), Main_IC_Sheet (14 pins), temperatuursmeting (C2.2 C3.1 IC2.4 R2.1)
GND: DisplayPrint (6 pins), Sturing_Bout (L2.2 R20.2 T4.3 T5.3), Voeding (10 pins), Main_IC_Sheet (12 pins), temperatuursmeting (11 pins)
VIN: Sturing_Bout (R17.1 T2.1 T3.3), Voeding (B1.1 C1.2 R3.2)
NetC6_1: Main_IC_Sheet (IC3.9), temperatuursmeting (C6.1 R5.1)
NetC12_1: Main_IC_Sheet (IC3.10), temperatuursmeting (C12.1 R14.1)
NetD2_1: Voeding (D2.1 R3.1 R6.1), Main_IC_Sheet (IC3.11)
NetIC3_19: Voeding (R7.1), Main_IC_Sheet (IC3.19)
NetR19_1: Sturing_Bout (R20.1 T4.2), Main_IC_Sheet (R19.1)